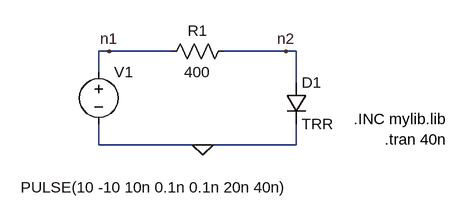
[diagram p0: schematic prob_3_new.asc]
prob_3_new.asc, the LTspice schematic file:
Version 4
SHEET 1 880 680
WIRE 16 64 0 64
WIRE 112 64 16 64
WIRE 288 64 192 64
WIRE 304 64 288 64
WIRE 0 96 0 64
WIRE 304 112 304 64
WIRE 0 208 0 176
WIRE 160 208 0 208
WIRE 304 208 304 176
WIRE 304 208 160 208
FLAG 160 208 0
FLAG 288 64 n2
FLAG 16 64 n1
SYMBOL res 208 48 R90
WINDOW 0 0 56 VBottom 2
WINDOW 3 32 56 VTop 2
SYMATTR InstName R1
SYMATTR Value 400
SYMBOL diode 288 112 R0
SYMATTR InstName D1
SYMATTR Value TRR
SYMBOL voltage 0 80 R0
WINDOW 3 -120 194 Left 2
WINDOW 123 0 0 Left 2
WINDOW 39 0 0 Left 2
SYMATTR Value PULSE(10 -10 10n 0.1n 0.1n 20n 40n)
SYMATTR InstName V1
TEXT 392 168 Left 2 !.INC mylib.lib
TEXT 440 200 Left 2 !.tran 40n

The netlist it stands for:
* prob_3_new.asc
R1 n2 n1 400
D1 n2 0 TRR
V1 n1 0 PULSE(10 -10 10n 0.1n 0.1n 20n 40n)
.model D D
.lib standard.dio
.INC mylib.lib
.tran 40n
.backanno
.end